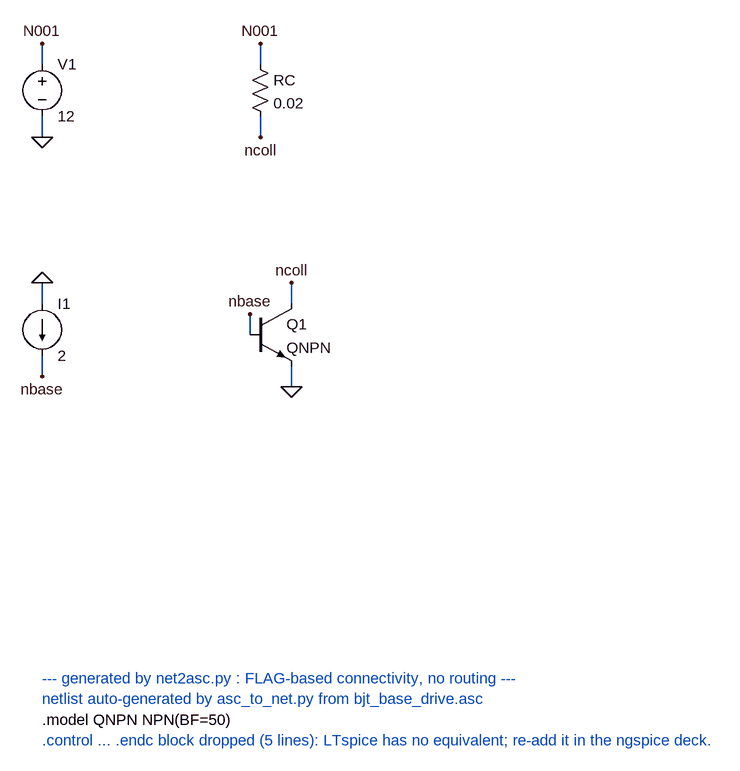
[diagram p0: schematic bjt_base_drive.asc]
bjt_base_drive.asc, the LTspice schematic file:
Version 4
SHEET 1 880 1256
WIRE 0 16 0 -16
WIRE 0 96 0 128
WIRE 336 16 336 -16
WIRE 336 96 336 128
WIRE 0 384 0 352
WIRE 0 464 0 496
WIRE 384 384 384 352
WIRE 320 432 320 400
WIRE 384 480 384 512
FLAG 0 -16 N001
FLAG 0 128 0
FLAG 336 -16 N001
FLAG 336 128 ncoll
FLAG 0 352 0
FLAG 0 496 nbase
FLAG 384 352 ncoll
FLAG 320 400 nbase
FLAG 384 512 0
SYMBOL voltage 0 0 R0
SYMATTR InstName V1
SYMATTR Value 12
SYMBOL res 320 0 R0
SYMATTR InstName RC
SYMATTR Value 0.02
SYMBOL current 0 384 R0
SYMATTR InstName I1
SYMATTR Value 2
SYMBOL npn 320 384 R0
SYMATTR InstName Q1
SYMATTR Value QNPN
TEXT 0 960 Left 2 ;--- generated by net2asc.py : FLAG-based connectivity, no routing ---
TEXT 0 992 Left 2 ;netlist auto-generated by asc_to_net.py from bjt_base_drive.asc
TEXT 0 1024 Left 2 !.model QNPN NPN(BF=50)
TEXT 0 1056 Left 2 ;.control ... .endc block dropped (5 lines): LTspice has no equivalent; re-add it in the ngspice deck.

The netlist it stands for:
* bjt_base_drive.asc
V1 N001 0 12
RC N001 ncoll 0.02
I1 0 nbase 2
Q1 ncoll nbase 0 0 QNPN
.model NPN NPN
.model PNP PNP
.lib standard.bjt
* --- generated by net2asc.py : FLAG-based connectivity, no routing ---
* netlist auto-generated by asc_to_net.py from bjt_base_drive.asc
.model QNPN NPN(BF=50)
* .control ... .endc block dropped (5 lines): LTspice has no equivalent; re-add it in the ngspice deck.
.backanno
.end